# EAGLE design Tractive System Active Light rev4 (EAGLE 9.6.2)
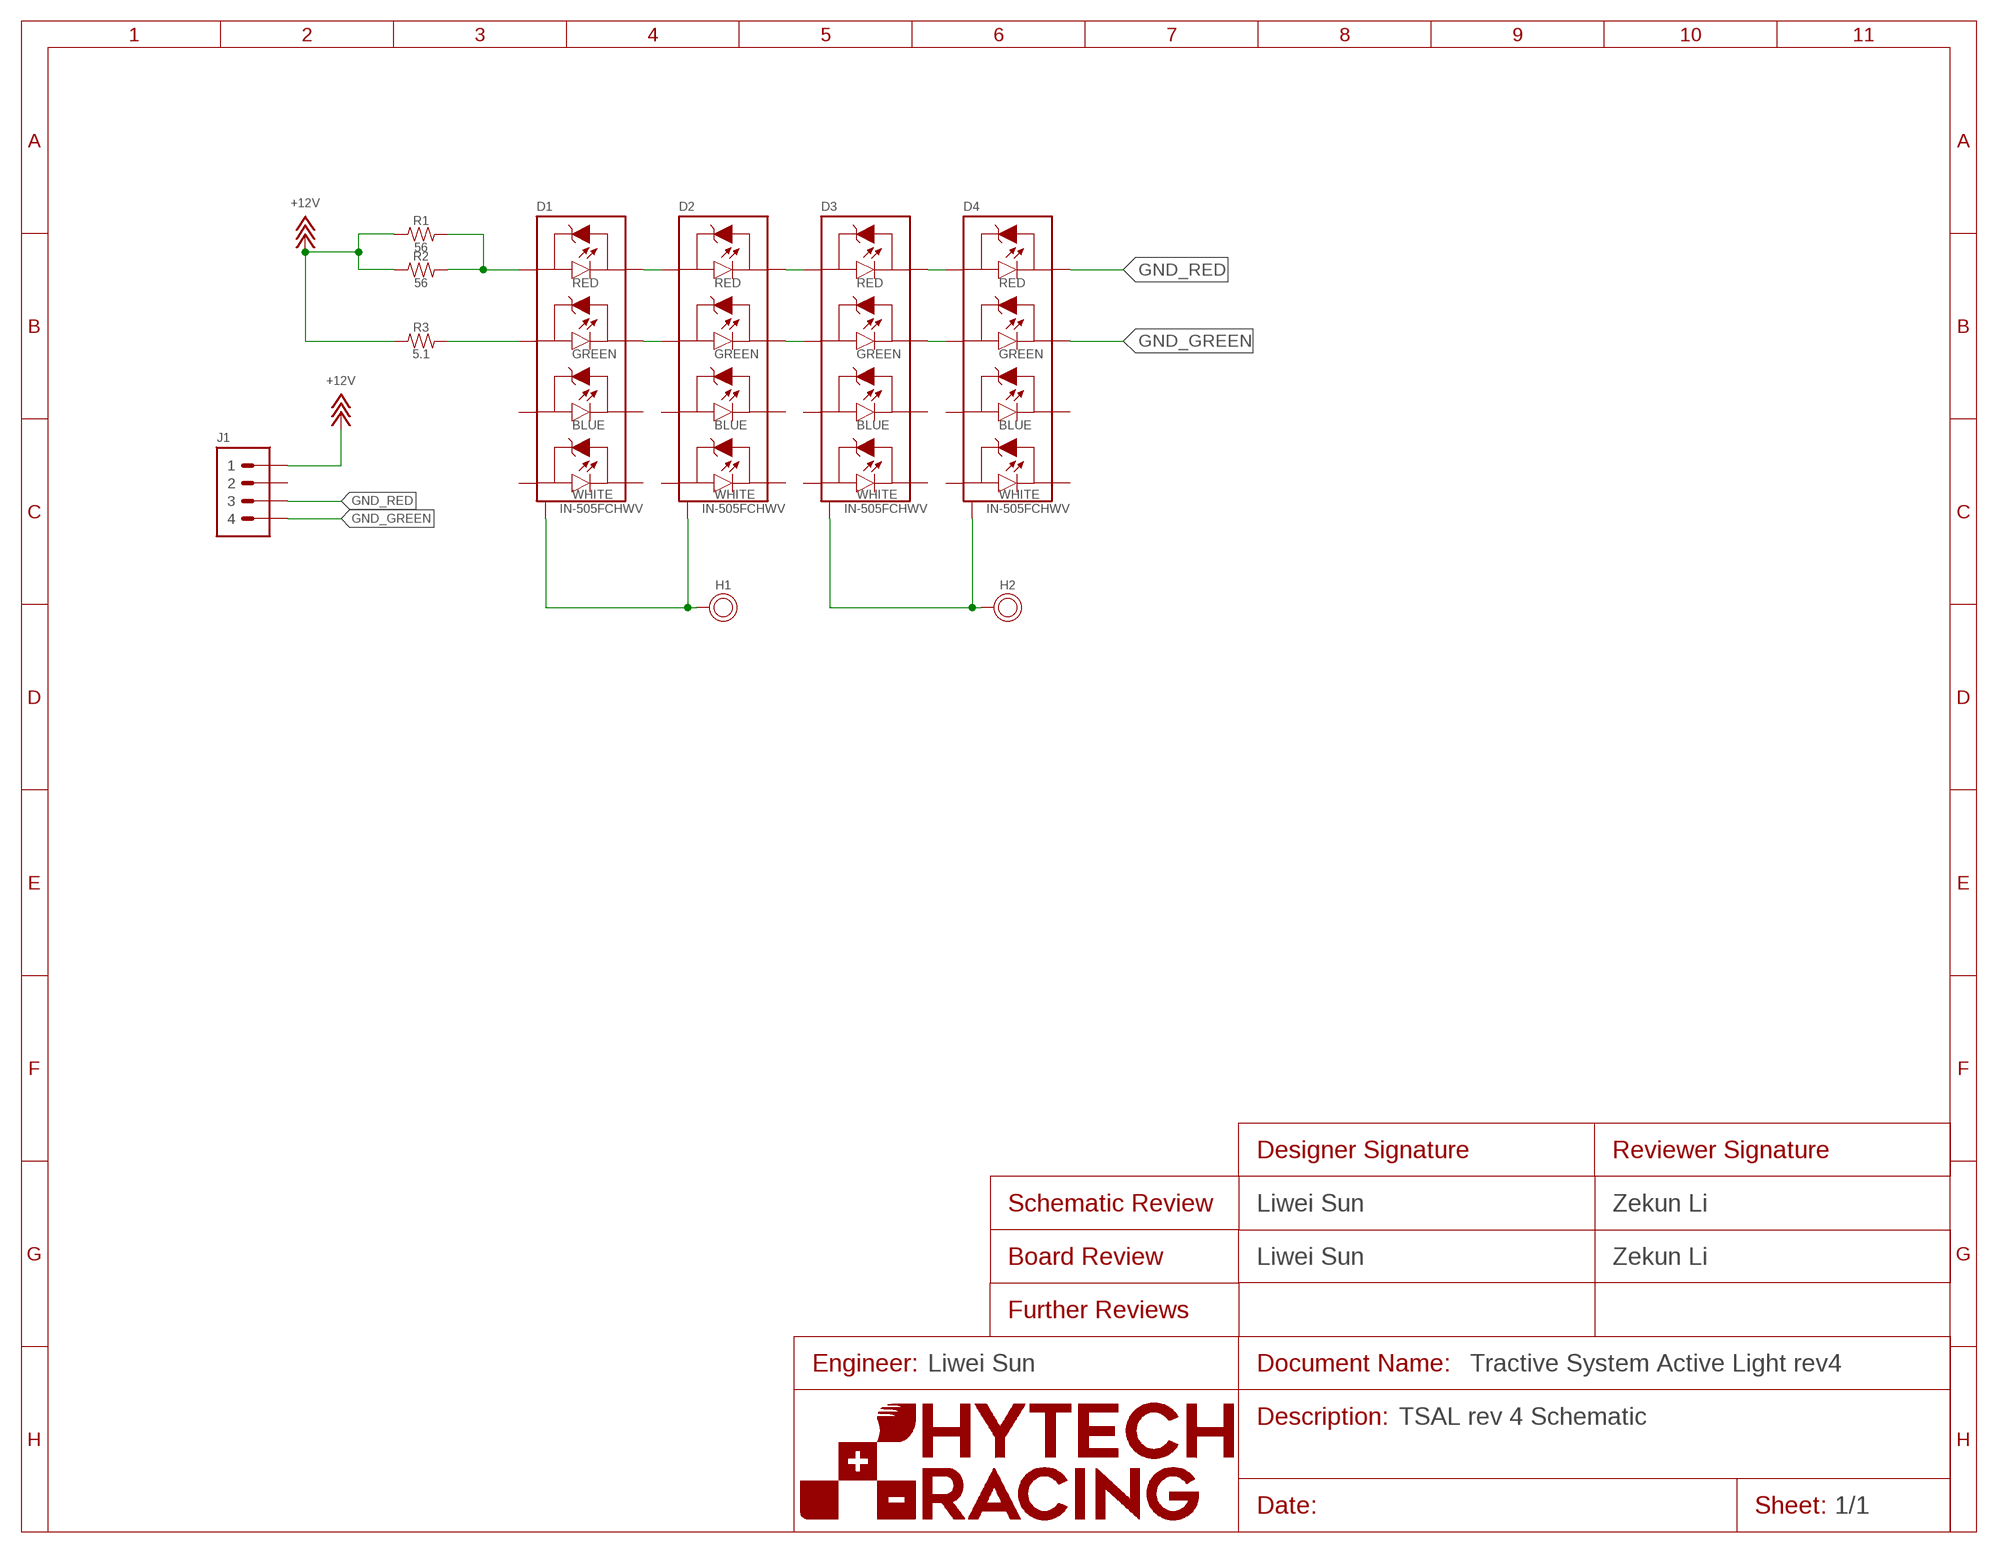
[diagram p0: schematic, sheet 1]
FRAME1 (FRAME): DESCRIPTION_1: TSAL rev 4 Schematic; DESIGNER_BOARD: Liwei Sun; DESIGNER_SCHEMATIC: Liwei Sun; ENGINEER: Liwei Sun; REVIEWER_BOARD: Zekun Li; REVIEWER_SCHEMATIC: Zekun Li

## Parts
D1  LED_RGBW_IN-505FCHWV  [IN-505FCHWV]
D2  LED_RGBW_IN-505FCHWV  [IN-505FCHWV]
D3  LED_RGBW_IN-505FCHWV  [IN-505FCHWV]
D4  LED_RGBW_IN-505FCHWV  [IN-505FCHWV]
H1  MOUNTING_HEATSINK_M3  [MOUNTING_M3]
H2  MOUNTING_HEATSINK_M3  [MOUNTING_M3]
J1  CONNECTOR-4_μF_S_RA_  [MOLEX_MICROFIT_SMD_RIGHTANGLE_04_DUAL]
R1  RESISTOR_0805_56  [0805-RES]
R2  RESISTOR_0805_56  [0805-RES]
R3  RESISTOR_0603_5.1  [0603-RES]

## Nets
+12V: J1.1 R1.1 R2.1 R3.1
GND_GREEN: D4.B-(GREEN-) J1.4
GND_RED: D4.A-(RED-) J1.3
N$1: D3.A-(RED-) D4.A+(RED+)
N$2: D3.B-(GREEN-) D4.B+(GREEN+)
N$3: D2.A-(RED-) D3.A+(RED+)
N$4: D2.B-(GREEN-) D3.B+(GREEN+)
N$5: D1.A-(RED-) D2.A+(RED+)
N$6: D1.B-(GREEN-) D2.B+(GREEN+)
N$7: D1.A+(RED+) R1.2 R2.2
N$8: D1.THERMAL D2.THERMAL H1.P$1
N$9: D1.B+(GREEN+) R3.2
N$13: D3.THERMAL D4.THERMAL H2.P$1
Unconnected: D1.C+(BLUE+) D1.C-(BLUE-) D1.D+(WHITE+) D1.D-(WHITE-) D2.C+(BLUE+) D2.C-(BLUE-) D2.D+(WHITE+) D2.D-(WHITE-) D3.C+(BLUE+) D3.C-(BLUE-) D3.D+(WHITE+) D3.D-(WHITE-) D4.C+(BLUE+) D4.C-(BLUE-) D4.D+(WHITE+) D4.D-(WHITE-) J1.2

## Library data of the parts
D1-D4 = HyTechDevices:LED_RGBW_*: Inolux IN-505FCHWV RGBW LED Datasheet <https://www.mouser.com/datasheet/2/180/IN-505FCHWV-1488542.pdf>; COLOR: RGBW; DKPN: 1830-1097-2-ND; MANUFACTURER: INOLUX; MOPN: 743-IN-505FCHWV; MPN: IN-505FCHWV
H1 H2 = HyTechDevices:MOUNTING_HEATSINK_*: M3 Mounting Hole Datasheet <https://www.engineersedge.com/iso_socket_head_screw.htm>
J1 = HyTechDevices:CONNECTOR-4_?_*; DKPN: WM1832CT-ND; MANUFACTURER: Molex; MOPN: 538-0430450411; MPN: 0430450411
R1 R2 = HyTechDevices:RESISTOR_?_*: Resistor PWR163 Series <https://www.mouser.com/datasheet/2/54/pwr163-777985.pdf> AC Series <https://www.mouser.com/datasheet/2/447/Yageo_PYu_AC_51_RoHS_L_7_1714230-1874691.pdf> PU Series <https://www.mouser.com/datasheet/2/447/PYu-PU_51_RoHS_L_6-1504619.pdf> ERA Series <https://www.mouser.com/datasheet/2/315/AOA0000C307-1149632.pdf> PWR263 Series <https://www.mouser.com/datasheet/2/54/pwr263s_35-778069.pdf> RC Series <https://www.mouser.com/datasheet/2/447/Yageo_03_18_2021_PYu_RC_Group_51_RoHS_L_11-2199992.pdf> ERJ PB3, PB6 Series <https://www.mouser.com/datasheet/2/315/AOA0000C328-1530132.pdf> ERJ PA2, P03, PA3, P06, P08, P14 Series <https://www.mouser.com/datasheet/2/315/AOA0000C331-1141874.pdf>; DKPN: P16053TR-ND; MANUFACTURER: Panasonic Electronic Components; MOPN: 667-ERJ-P06D56R0V; MPN: ERJ-P06D56R0V; POWER: 0.5W; RESISTANCE: 56; TOLERANCE: 5%; VOLTAGE_CONTINUOUS: 5.29V; VOLTAGE_MAX: 400V
R3 = HyTechDevices:RESISTOR_?_*: Resistor PWR163 Series <https://www.mouser.com/datasheet/2/54/pwr163-777985.pdf> AC Series <https://www.mouser.com/datasheet/2/447/Yageo_PYu_AC_51_RoHS_L_7_1714230-1874691.pdf> PU Series <https://www.mouser.com/datasheet/2/447/PYu-PU_51_RoHS_L_6-1504619.pdf> ERA Series <https://www.mouser.com/datasheet/2/315/AOA0000C307-1149632.pdf> PWR263 Series <https://www.mouser.com/datasheet/2/54/pwr263s_35-778069.pdf> RC Series <https://www.mouser.com/datasheet/2/447/Yageo_03_18_2021_PYu_RC_Group_51_RoHS_L_11-2199992.pdf> ERJ PB3, PB6 Series <https://www.mouser.com/datasheet/2/315/AOA0000C328-1530132.pdf> ERJ PA2, P03, PA3, P06, P08, P14 Series <https://www.mouser.com/datasheet/2/315/AOA0000C331-1141874.pdf>; DKPN: P16039TR-ND; MANUFACTURER: Panasonic Electronic Components; MOPN: 667-ERJ-P03J5R1V; MPN: ERJ-P03J5R1V; POWER: 0.25W; RESISTANCE: 5.1; TOLERANCE: 1%; VOLTAGE_CONTINUOUS: 1.13V; VOLTAGE_MAX: 150V

## Board
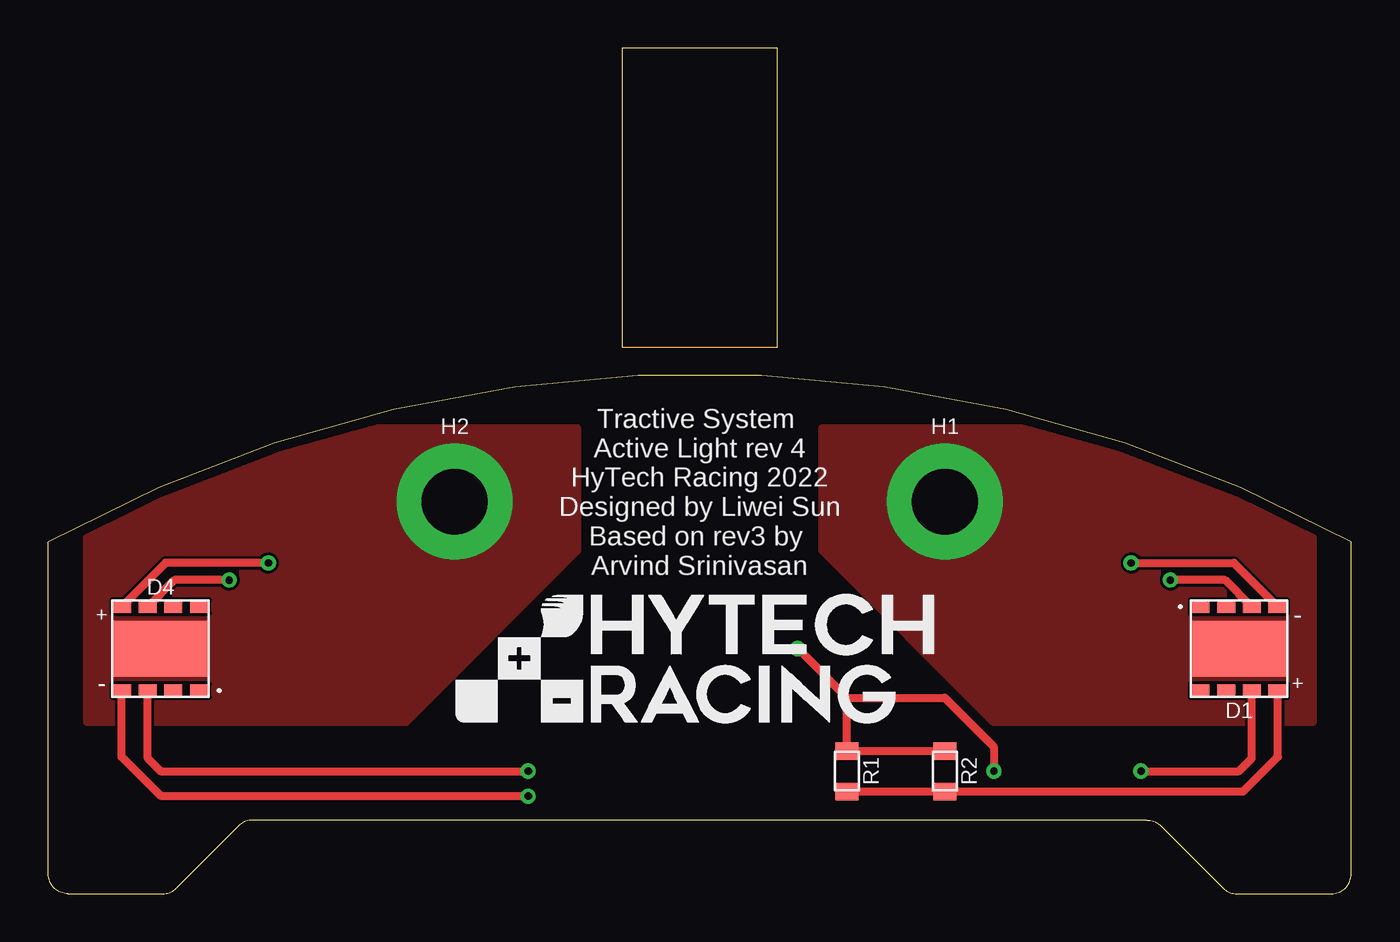
[diagram p1: board, top side]
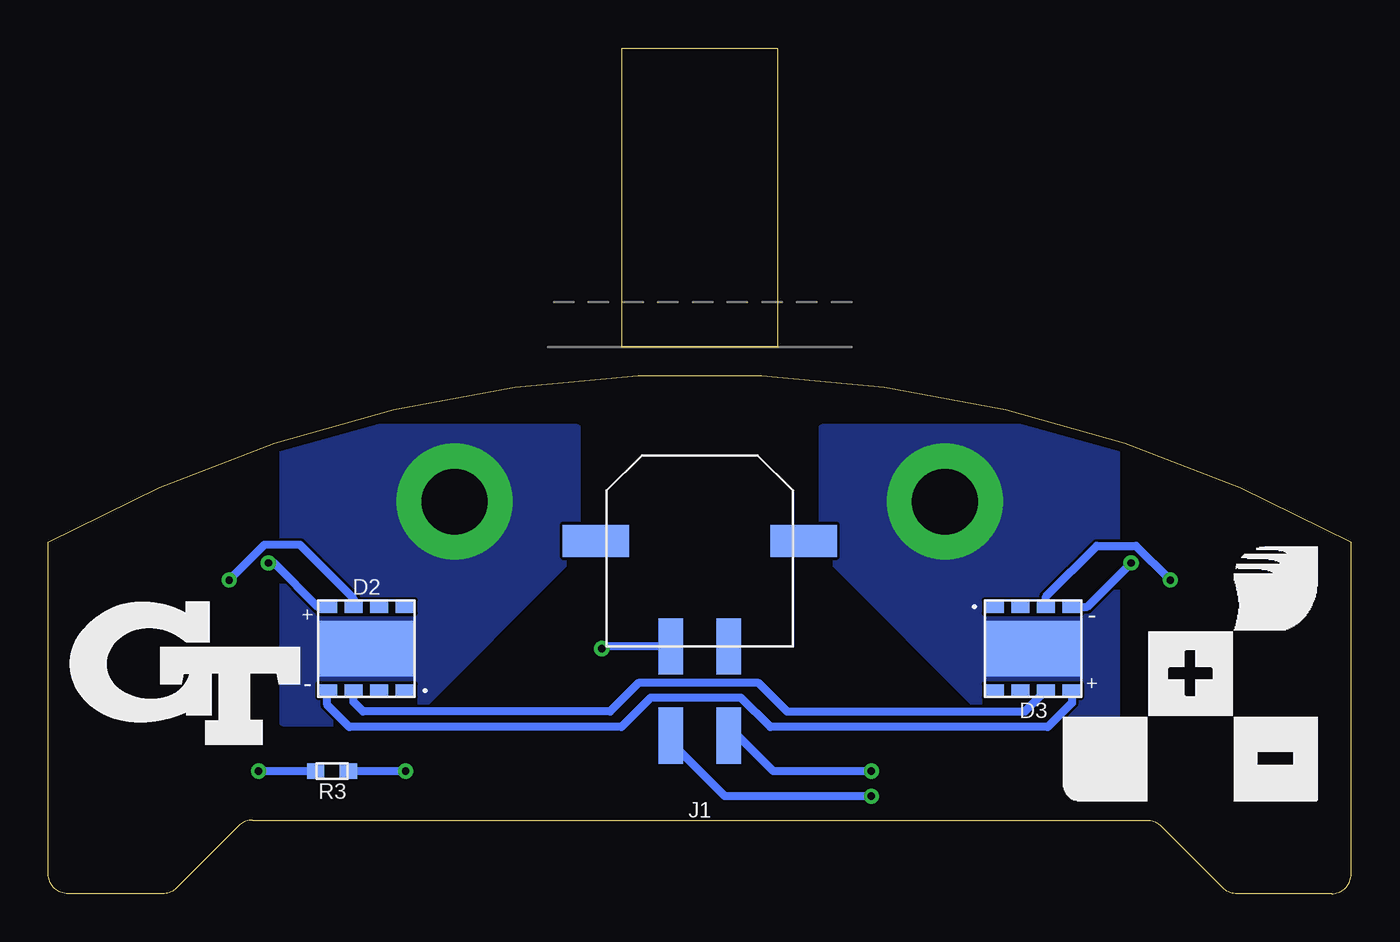
[diagram p2: board, bottom side, seen from below]

Size 67.51 x 26.85 mm. Coordinates in mm from the lower left corner, seen from the top.
Outline: 57.65,3.51 60.87,0.3 arc45 61.58,0 66.5,0 arc90 67.51,1.02 67.51,18.22 arc58 0,18.22 0,1.02 arc90 1.02,0 5.93,0 arc45 6.65,0.3 9.86,3.51 arc-45 10.58,3.81 56.93,3.81 arc-45 57.65,3.51
Copper layers (1*16): Top 0.035mm / dielectric 1.53mm / Bottom 0.035mm
Design rules "HyTech Default (2 Layer)": minimum track width 6mil, minimum drill 14mil, track to track 6mil, track to pad 6mil, pad to pad 6mil, via to via 20mil, smd to smd 6mil, copper to edge 20mil, drill to drill 21mil, minimum pad ring 7mil, minimum via ring 8mil, stop-mask expansion 6mil, vias tented up to drill 30mil, thermal gap 10mil

### Footprints (pad centres in the part's own frame; a part is rotated, then mirrored left to right if it is on the bottom)
IN-505FCHWV = smd 0.975 x 0.65: A+ -2.013,2.175; A- -2.013,-2.175; D+ 2.013,2.175; D- 2.013,-2.175 | smd 0.925 x 0.65: B+ -0.662,2.175; B- -0.662,-2.175; C+ 0.662,2.175; C- 0.662,-2.175 | smd 5 x 2.9: THERMAL 0,0
MOUNTING_M3 = drill 3.4 pad 6: P$1 0,0
MOLEX_MICROFIT_SMD_RIGHTANGLE_04_DUAL = smd 1.27 x 2.921: 1 1.5,5.474; 2 -1.5,5.474; 3 1.5,10.097; 4 -1.5,10.097 | smd 3.429 x 1.651: PAD1 5.386,0; PAD2 -5.386,0
0805-RES = smd 0.9 x 1.2: 1 -1.05,0; 2 1.05,0
0603-RES = smd 0.9 x 0.8: 1 -0.85,0; 2 0.85,0

### Placement (x,y rotation side)
D1  61.7,12.7 180 top
D2  51.03,12.7 0 bottom
D3  16.48,12.7 180 bottom
D4  5.82,12.7 0 top
H1  46.46,20.32 0 top
H2  21.06,20.32 0 top
J1  33.76,18.29 180 bottom
R1  41.38,6.35 270 top
R2  46.46,6.35 270 top
R3  52.81,6.35 180 bottom
U$1  [LOGO_HYTECH_SQUARE_EXTRA_LARGE]  8.36,11.43 0 bottom
U$2  [LOGO_HYTECH_MEDIUM]  21.06,8.89 0 top
U$3  [LOGO_GT_MEDIUM]  60.43,11.43 0 bottom

### Tracks (layer width: path | path; a pad name or v marks a point on that pad's centre or on a via)
+12V  (via drill 0.38)
  Top 0.406: R2.1 R1.1 41.38,10.16 | v38.84,12.7 41.38,10.16 | 41.38,10.16 46.46,10.16 49,7.62 v49,6.35
  Bottom 0.406: J1.1 38.72,12.81 v38.84,12.7 | v49,6.35 R3.1
GND_GREEN  (via drill 0.38)
  Top 0.406: D4.B- 5.15,7.01 5.82,6.35 v24.87,6.35
  Bottom 0.406: v24.87,6.35 29.95,6.35 31.79,8.19 J1.4
GND_RED  (via drill 0.38)
  Top 0.406: D4.A- 3.8,7.09 5.82,5.08 24.84,5.08 v24.87,5.05
  Bottom 0.406: v24.87,5.05 32.46,5.05 35.26,7.85 J1.3
N$1  (via drill 0.38)
  Top 0.406: v11.4,17.14 6.07,17.14 D4.A+
  Bottom 0.406: D3.A- 13.67,14.88 v11.4,17.14
N$2  (via drill 0.38)
  Top 0.406: v9.37,16.26 6.54,16.26 D4.B+
  Bottom 0.406: v9.37,16.26 11.15,18.03 13.18,18.03 15.82,15.4 D3.B-
N$3
  Bottom 0.406: D3.A+ 14.47,9.89 15.72,8.64 30.1,8.64 31.63,10.16 36.3,10.16 37.82,8.64 51.92,8.64 53.06,9.78 53.06,10.51 D2.A-
N$4
  Bottom 0.406: D3.B+ 16.9,9.45 29.24,9.45 30.71,10.92 36.93,10.92 38.41,9.45 51.21,9.45 51.69,9.93 D2.B-
N$5  (via drill 0.38)
  Top 0.406: v56.11,17.14 61.44,17.14 D1.A-
  Bottom 0.406: v56.11,17.14 55.82,17.14 53.55,14.88 D2.A+
N$6  (via drill 0.38)
  Top 0.406: D1.B- 60.98,16.26 v58.14,16.26
  Bottom 0.406: v58.14,16.26 56.32,18.07 54.46,18.07 51.69,15.3 D2.B+
N$7
  Top 0.406: R1.2 R2.2 61.92,5.3 63.71,7.09 D1.A+
N$8
  pour Top (no thermals): 40.11,24.13 65.51,24.13 65.51,8.89 49,8.89 40.11,17.78
  pour Bottom (no thermals): 40.11,24.13 55.35,24.13 55.35,8.89 49,8.89 40.11,17.78
N$9  (via drill 0.38)
  Top 0.406: D1.B+ 62.36,7.01 61.7,6.35 v56.62,6.35
  Bottom 0.406: R3.2 v56.62,6.35
N$13
  pour Top (rank 5, no thermals): 2.01,24.13 27.41,24.13 27.41,17.78 18.52,8.89 2.01,8.89
  pour Bottom (no thermals): 27.41,24.13 27.41,17.78 18.52,8.89 12.17,8.89 12.17,24.13

### Text on the board
tPlace: Tractive System / Active Light rev 4 / HyTech Racing 2022 / Designed by Liwei Sun / Based on rev3 by / Arvind Srinivasan